# EAGLE design wctrl_3dsense (EAGLE 7.7.0)
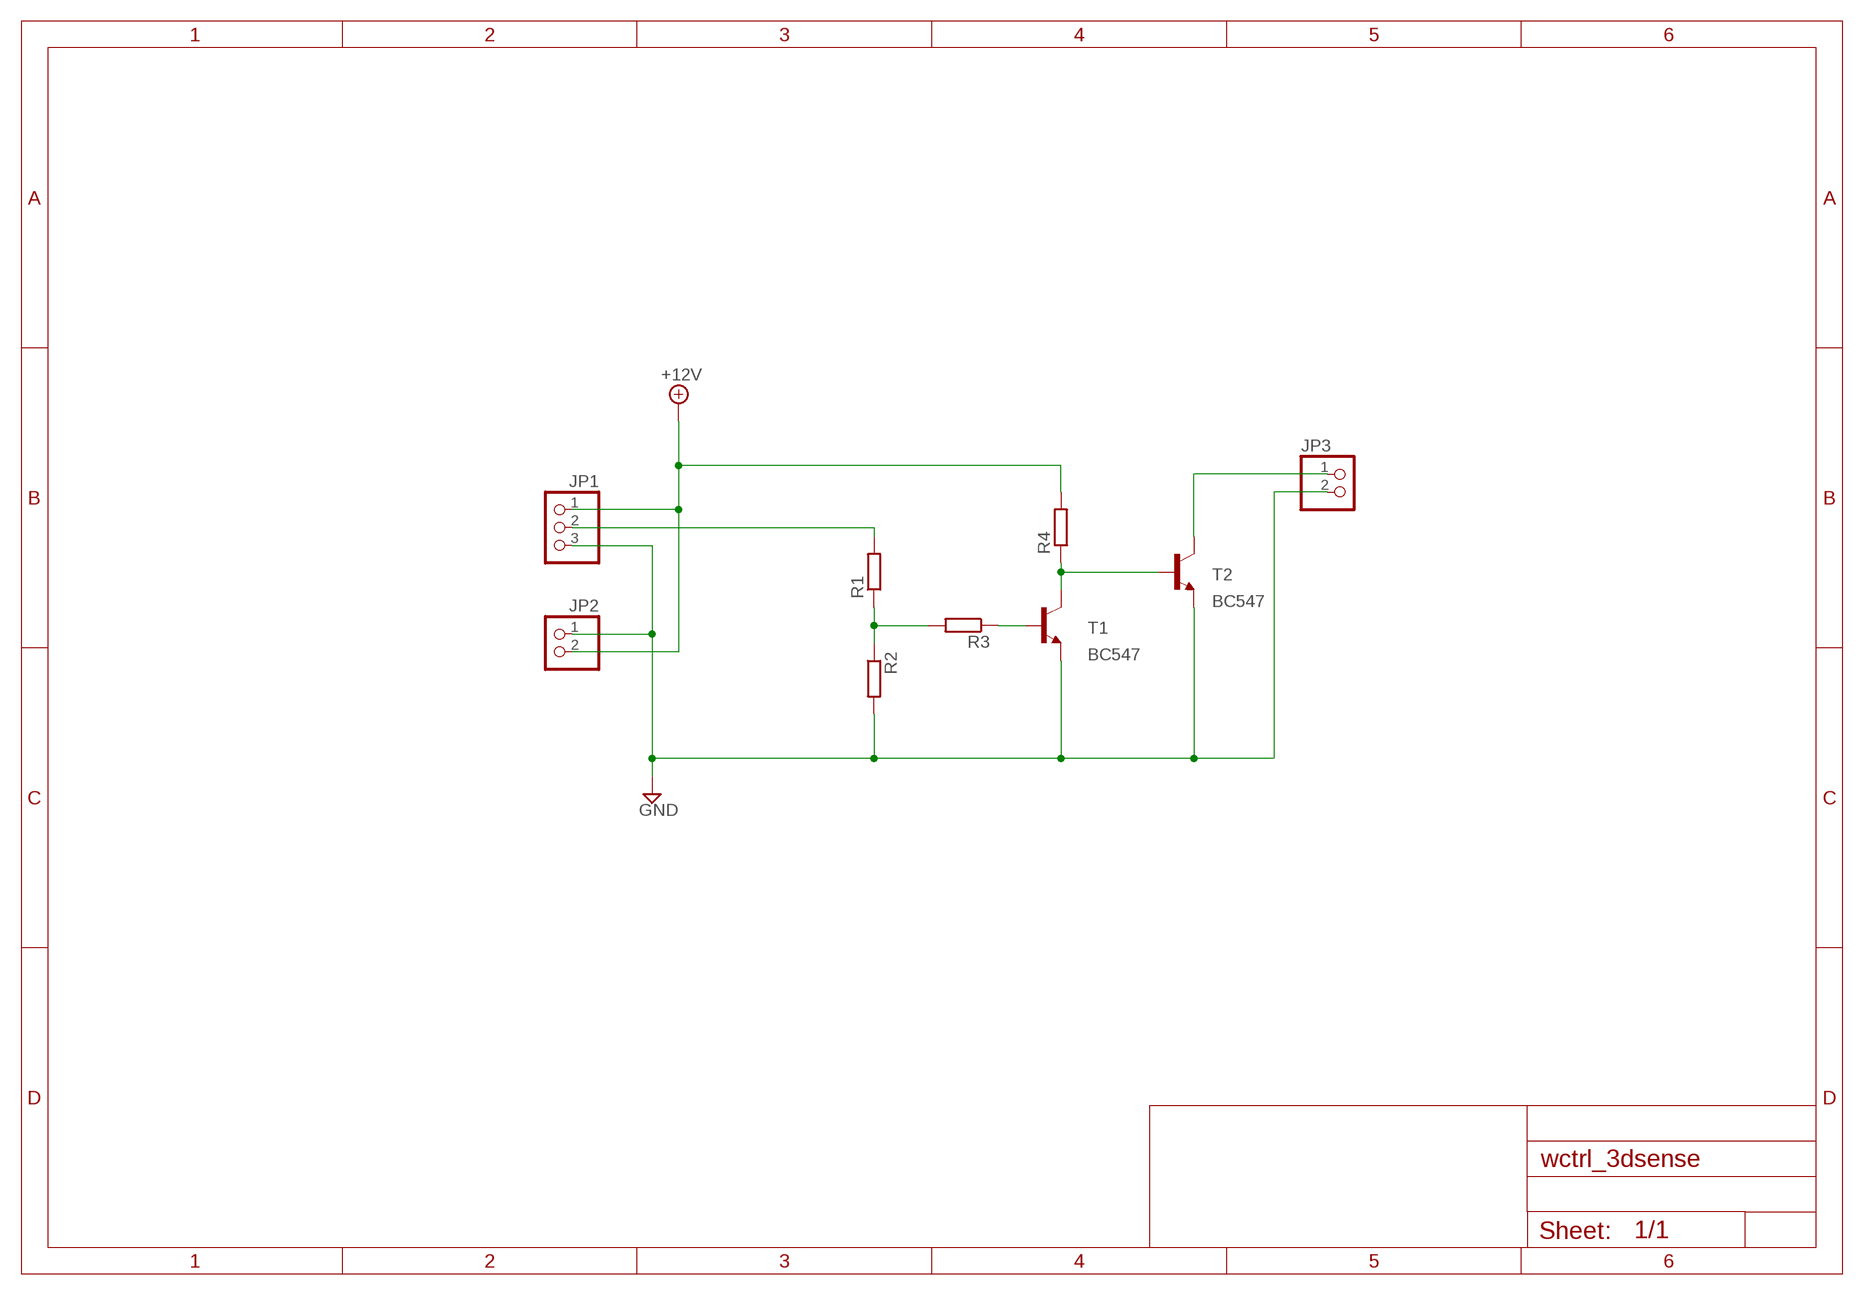
[diagram p0: schematic, sheet 1]

## Parts
JP1  PINHD-1X3  [1X03]
JP2  PINHD-1X2  [1X02]
JP3  PINHD-1X2  [1X02]
R1  R-EU_0207/10  [0207/10]
R2  R-EU_0207/10  [0207/10]
R3  R-EU_0207/10  [0207/10]
R4  R-EU_0207/10  [0207/10]
T1  BC547  [TO92]
T2  BC547  [TO92]

## Nets
+12V: JP1.1 JP2.2 R4.2
GND: JP1.3 JP2.1 JP3.2 R2.2 T1.1(E) T2.1(E)
N$1: JP1.2 R1.2
N$2: R1.1 R2.1 R3.2
N$3: R3.1 T1.2(B)
N$4: JP3.1 T2.3(C)
N$5: R4.1 T1.3(C) T2.2(B)

## Library data of the parts
JP1 = pinhead:PINHD-1X3: PIN HEADER
JP2 JP3 = pinhead:PINHD-1X2: PIN HEADER
R1-R4 = rcl:R-EU_: RESISTOR, European symbol
T1 T2 = transistor:BC547: NPN TRANSISTOR

## Board
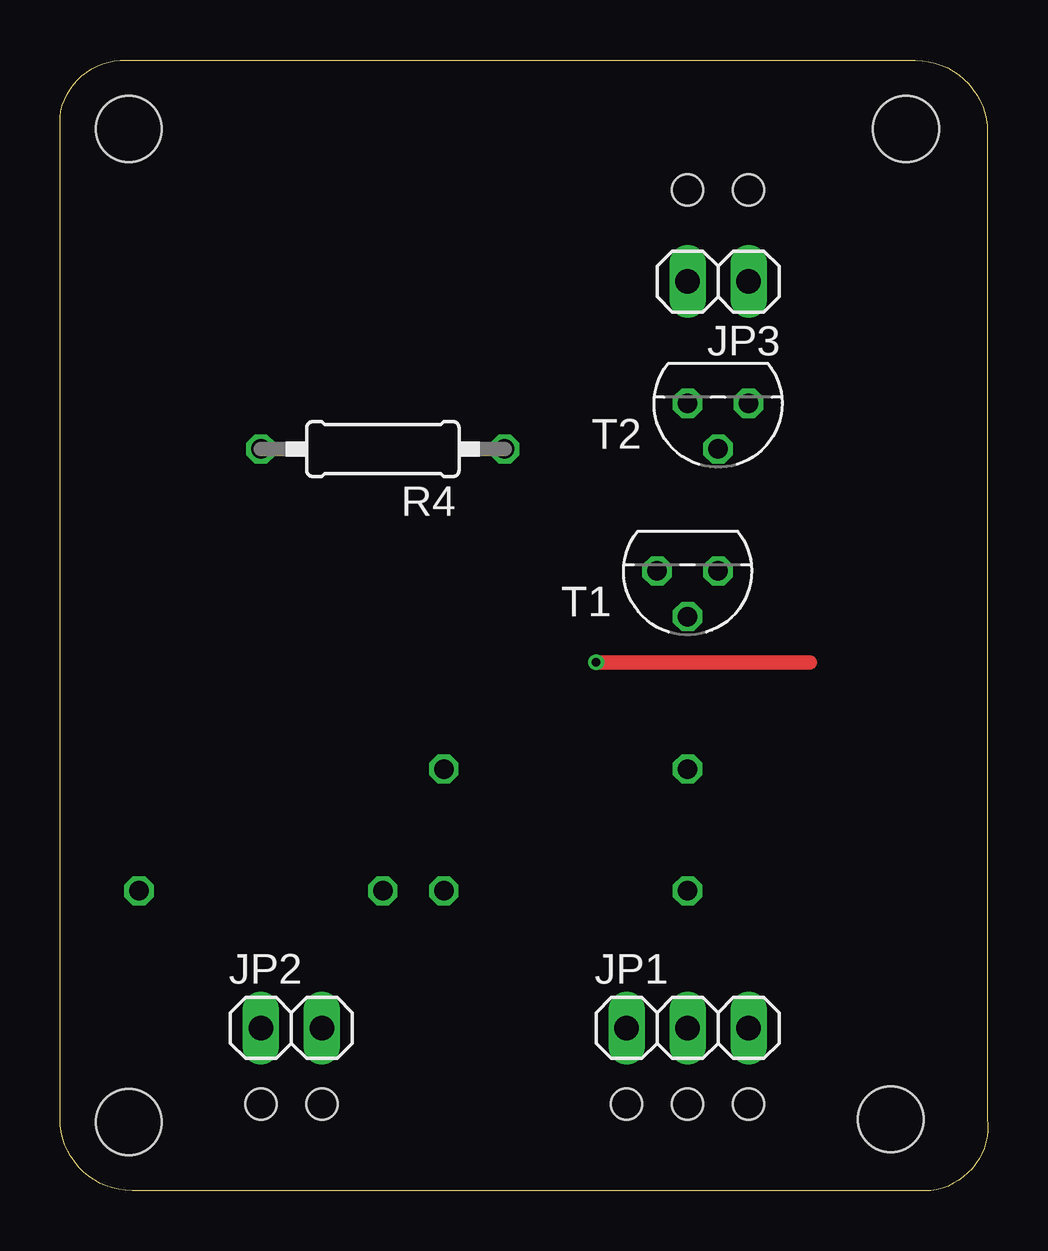
[diagram p1: board, top side]
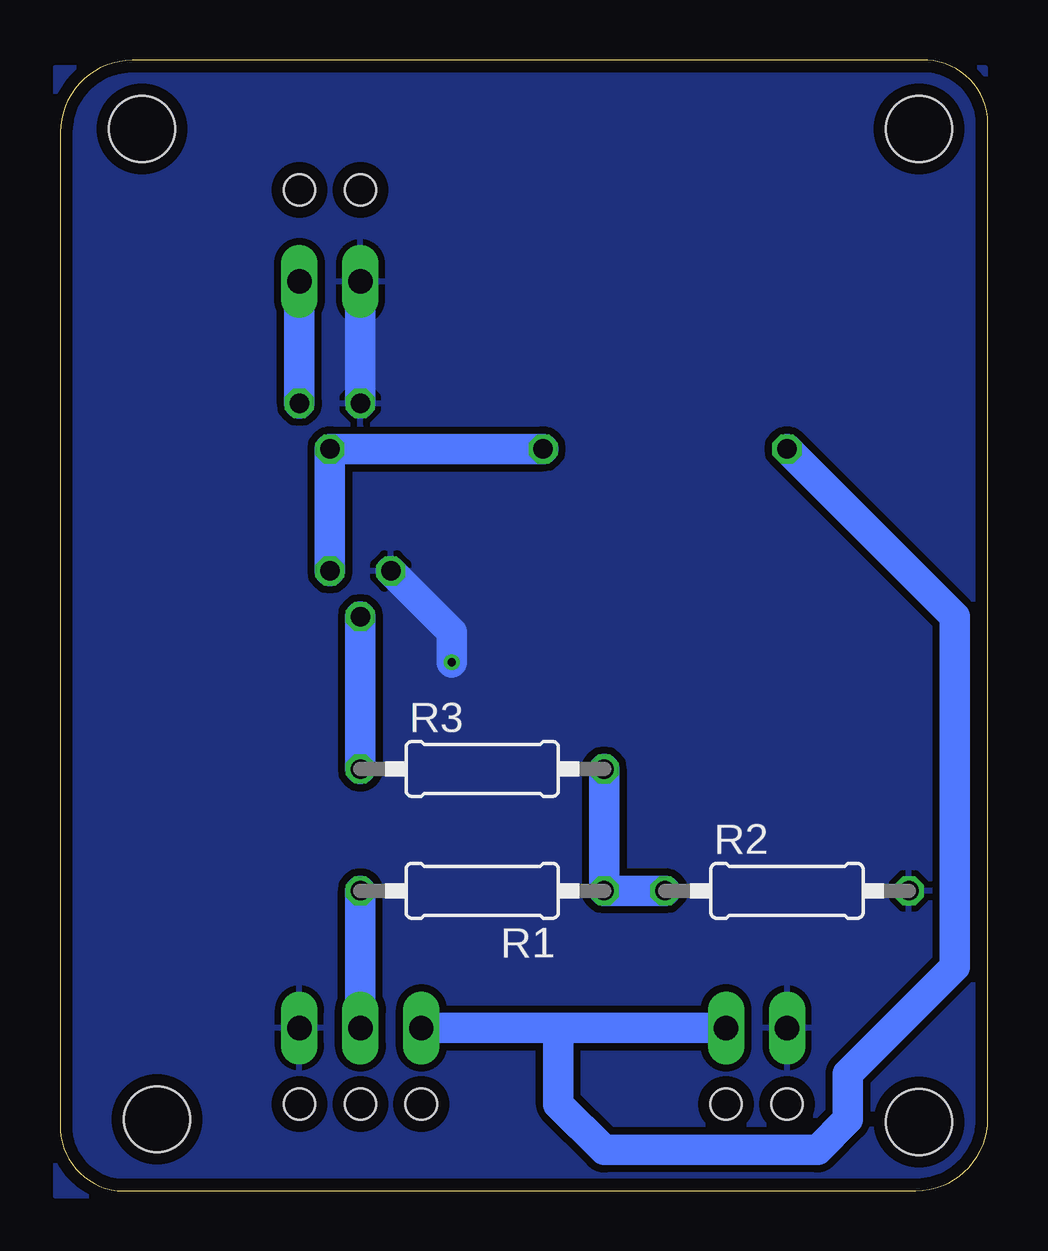
[diagram p2: board, bottom side, seen from below]

Size 38.66 x 47.13 mm. Coordinates in mm from the lower left corner, seen from the top.
Outline: 0,44.75 arc-90 3,47.11 35.64,47.11 arc-90 38.64,44.11 38.64,3 arc-90 36.28,0 3,0 arc-90 0,3 0,44.75
Copper layers (1*16): Top 0.035mm / dielectric 1.6mm / Bottom 0.035mm
Design rules "Elecrow_2-layer_PCB_eagle_rule": minimum track width 6mil, minimum drill 12mil, track to track 6mil, track to pad 6mil, pad to pad 6mil, via to via 8mil, smd to smd 0mil, copper to edge 20mil, drill to drill 10mil, minimum pad ring 6mil, minimum via ring 6mil, stop-mask expansion 0mil, vias tented up to drill 100mil, thermal gap 10mil
Holes 2.75 mm at 2.86,44.25 2.86,2.86 35.25,44.25 34.61,2.97
Holes 1.3 mm at 26.15,3.6 23.61,3.6 28.69,3.6 10.91,3.6 8.37,3.6 28.69,41.7 26.15,41.7

### Footprints (pad centres in the part's own frame; a part is rotated, then mirrored left to right if it is on the bottom)
1X03 = drill 1.016 long: 1 -2.54,0; 2 0,0; 3 2.54,0
1X02 = drill 1.016 long: 1 -1.27,0; 2 1.27,0
0207/10 = drill 0.813 octagon: 1 -5.08,0; 2 5.08,0
TO92 = drill 0.813 octagon: 1 1.27,0; 2 0,1.905; 3 -1.27,0

### Placement (x,y rotation side)
JP1  26.15,6.78 0 top
JP2  9.64,6.78 0 top
JP3  27.42,37.9 180 top
R1  21.07,12.49 180 bottom
R2  8.37,12.49 0 bottom
R3  21.07,17.58 0 bottom
R4  13.45,30.91 180 top
T1  26.15,25.83 180 top
T2  27.42,32.82 180 top

### Tracks (layer width: path | path; a pad name or v marks a point on that pad's centre or on a via)
+12V
  Bottom 1.27: R4.2 1.39,23.93 1.39,9.32 5.83,4.88 5.83,2.97 7.1,1.7 15.99,1.7 17.89,3.6 17.89,6.78 | JP1.1 17.89,6.78 | 17.89,6.78 JP2.2
GND  (via drill 0.35)
  Top 0.61: v22.34,22.02 31.23,22.02
  Bottom 1.27: JP3.2 T2.1 | T1.1 22.34,23.29 v22.34,22.02
  pour Bottom (isolate 0.3): 0.11,46.79 38.85,46.79 38.85,-0.2 3.54,-0.2 arc-90 0.11,3.22
N$1
  Bottom 1.27: JP1.2 R1.2
N$2
  Bottom 1.27: R3.2 R1.1 R2.1
N$3
  Bottom 1.27: T1.2 R3.1
N$4
  Bottom 1.27: T2.3 JP3.1
N$5
  Bottom 1.27: T1.3 T2.2 R4.1

### Text on the board
tTest: GND | SDA | SCL | INTB | INTA | 3.3V | 3.3Ve | 5V | 5Ve
bRestrict: WCTRL_ / 3DSENSE | PN39XXXR0B0